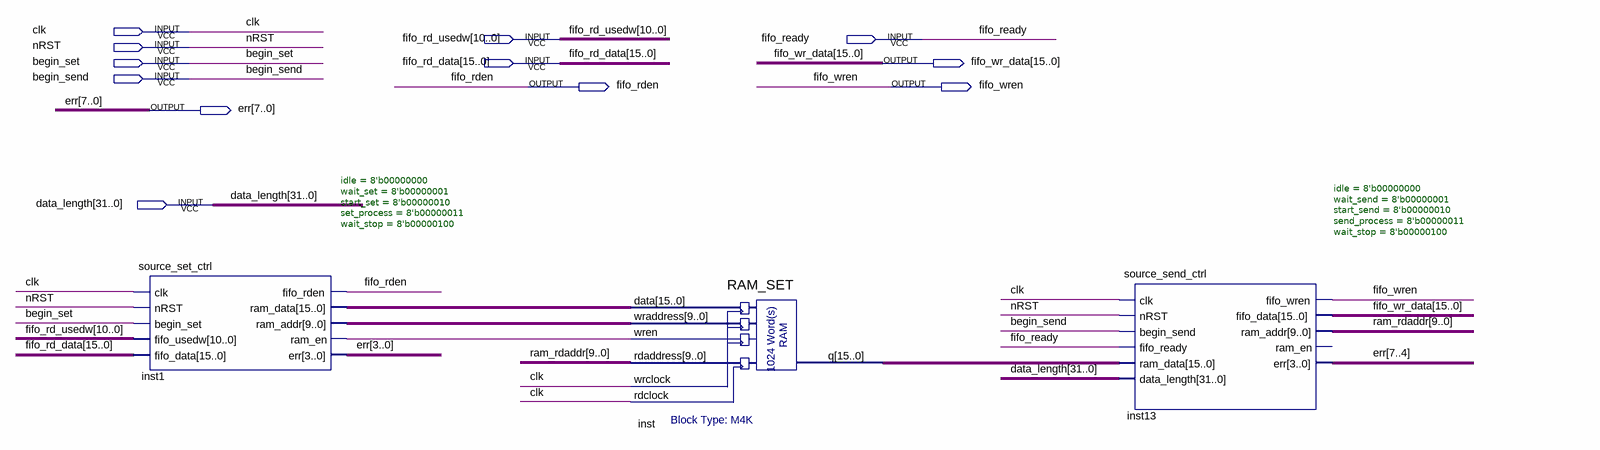
[diagram p0: schematic sheet]
// Quartus schematic set_source.bdf as structural Verilog: 3 symbols, 12 pins
module set_source (
  input  clk,
  input  [10:0] fifo_rd_usedw,
  input  fifo_ready,
  input  nRST,
  input  begin_set,
  input  [15:0] fifo_rd_data,
  input  begin_send,
  input  [31:0] data_length,
  output [15:0] fifo_wr_data,
  output fifo_rden,
  output fifo_wren,
  output [7:0] err
);

  wire inst1_ram_en;
  wire [9:0] inst1_ram_addr, ram_rdaddr;
  wire [15:0] inst1_ram_data, inst_q;

  source_set_ctrl #(.idle(8'b00000000), .wait_set(8'b00000001), .start_set(8'b00000010), .set_process(8'b00000011), .wait_stop(8'b00000100)) inst1 (
    .clk(clk), .nRST(nRST), .begin_set(begin_set), .fifo_usedw(fifo_rd_usedw), .fifo_data(fifo_rd_data),
    .fifo_rden(fifo_rden), .ram_data(inst1_ram_data), .ram_addr(inst1_ram_addr), .ram_en(inst1_ram_en),
    .err(err[3:0]));
  RAM_SET inst (
    .data(inst1_ram_data), .wraddress(inst1_ram_addr), .wren(inst1_ram_en), .rdaddress(ram_rdaddr),
    .wrclock(clk), .rdclock(clk), .q(inst_q));
  source_send_ctrl #(.idle(8'b00000000), .wait_send(8'b00000001), .start_send(8'b00000010), .send_process(8'b00000011), .wait_stop(8'b00000100)) inst13 (
    .clk(clk), .nRST(nRST), .begin_send(begin_send), .fifo_ready(fifo_ready), .ram_data(inst_q),
    .data_length(data_length), .fifo_wren(fifo_wren), .fifo_data(fifo_wr_data), .ram_addr(ram_rdaddr),
    .err(err[7:4]));  // open: ram_en
endmodule
